# Altium schematic sheet Sheet2.SchDoc
size A; SheetNumber: 2; SheetTotal: 3
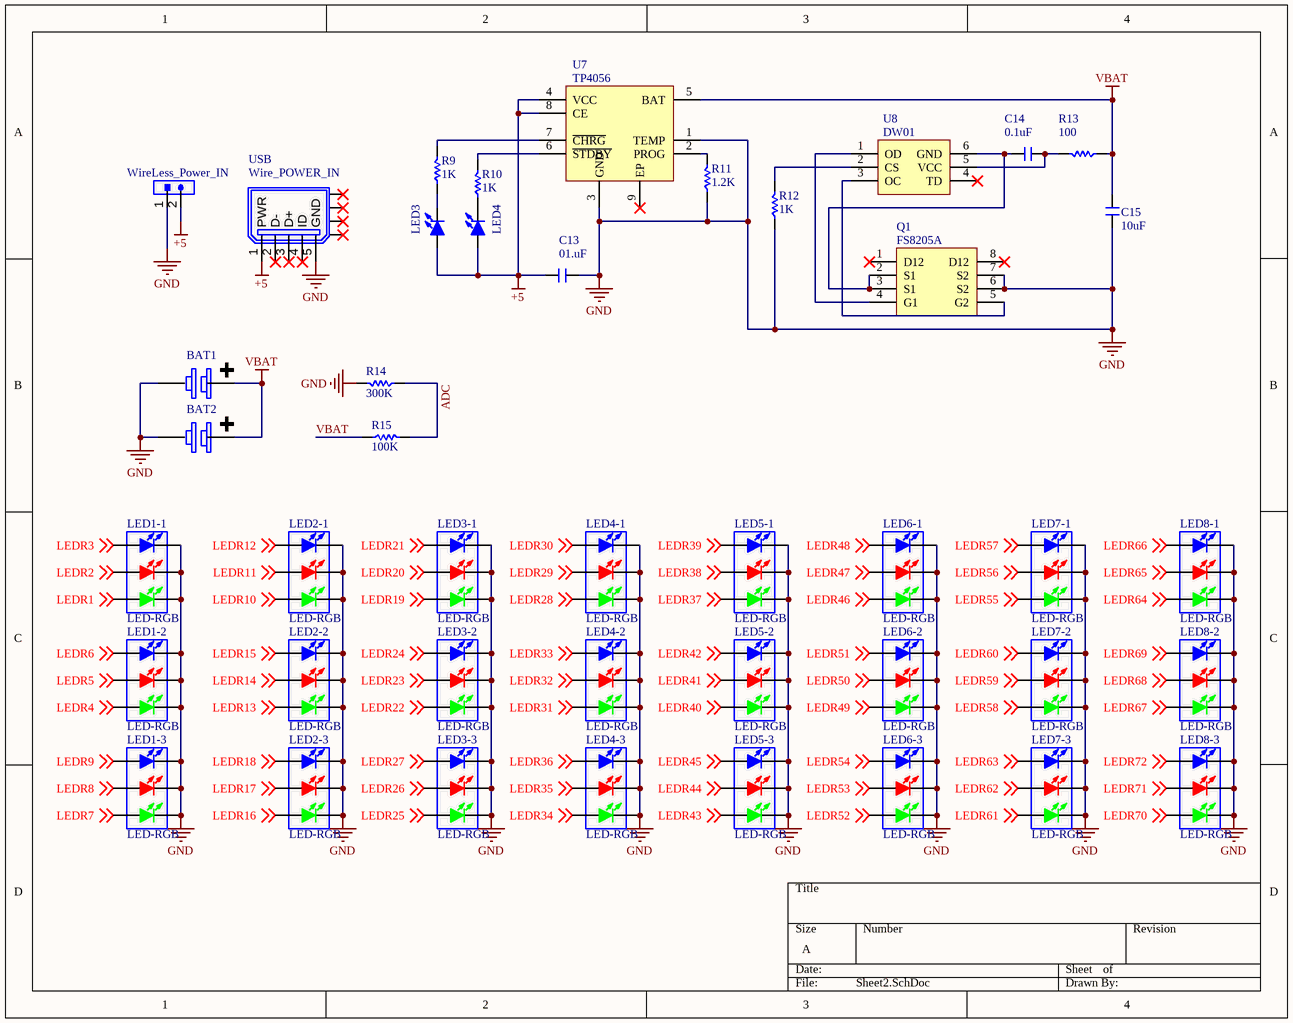
[diagram p0: Sheet2.SchDoc]

## Parts
BAT1  Battery 1850  [18650 Single]  (value not drawn)
BAT2  Battery 1850  [18650 Single]  (value not drawn)
C13  01.uF  [C 0402]
C14  0.1uF  [C 0402]
C15  10uF  [C 0603]
LED1-1  LED-RGB  [LED 5050]
LED1-2  LED-RGB  [LED 5050]
LED1-3  LED-RGB  [LED 5050]
LED2-1  LED-RGB  [LED 5050]
LED2-2  LED-RGB  [LED 5050]
LED2-3  LED-RGB  [LED 5050]
LED3  LED-SMD  [LED 0805R]  (value not drawn)
LED3-1  LED-RGB  [LED 5050]
LED3-2  LED-RGB  [LED 5050]
LED3-3  LED-RGB  [LED 5050]
LED4  LED-SMD  [LED 0805G]  (value not drawn)
LED4-1  LED-RGB  [LED 5050]
LED4-2  LED-RGB  [LED 5050]
LED4-3  LED-RGB  [LED 5050]
LED5-1  LED-RGB  [LED 5050]
LED5-2  LED-RGB  [LED 5050]
LED5-3  LED-RGB  [LED 5050]
LED6-1  LED-RGB  [LED 5050]
LED6-2  LED-RGB  [LED 5050]
LED6-3  LED-RGB  [LED 5050]
LED7-1  LED-RGB  [LED 5050]
LED7-2  LED-RGB  [LED 5050]
LED7-3  LED-RGB  [LED 5050]
LED8-1  LED-RGB  [LED 5050]
LED8-2  LED-RGB  [LED 5050]
LED8-3  LED-RGB  [LED 5050]
Q1  FS8205A  [SSOP8_L]
R9  1K  [R 0402]
R10  1K  [R 0402]
R11  1.2K  [R 0402]
R12  1K  [R 0402]
R13  100  [R 0402]
R14  300K  [R 0805]
R15  100K  [R 0805]
U7  TP4056  [SOP8_M-EP]
U8  DW01  [SOT23-6M]
USB  Wire_POWER_IN  [USB-micro_B]
WireLess_Power_IN  HDR-1X2  [XH2.54-2P]  (value not drawn)

## Nets
+5: C13.2 LED3.1(A) LED4.1(A) U7.4(VCC) U7.8(CE) USB.1(PWR) WireLess_Power_IN.2
GND: BAT1.2(-) BAT2.2(-) C13.1 C15.1 LED1-1.2(BULE_K) LED1-1.4(RED_K) LED1-1.6(GREEN_K) LED1-2.2(BULE_K) LED1-2.4(RED_K) LED1-2.6(GREEN_K) LED1-3.2(BULE_K) LED1-3.4(RED_K) LED1-3.6(GREEN_K) LED2-1.2(BULE_K) LED2-1.4(RED_K) LED2-1.6(GREEN_K) LED2-2.2(BULE_K) LED2-2.4(RED_K) LED2-2.6(GREEN_K) LED2-3.2(BULE_K) LED2-3.4(RED_K) LED2-3.6(GREEN_K) LED3-1.2(BULE_K) LED3-1.4(RED_K) LED3-1.6(GREEN_K) LED3-2.2(BULE_K) LED3-2.4(RED_K) LED3-2.6(GREEN_K) LED3-3.2(BULE_K) LED3-3.4(RED_K) LED3-3.6(GREEN_K) LED4-1.2(BULE_K) LED4-1.4(RED_K) LED4-1.6(GREEN_K) LED4-2.2(BULE_K) LED4-2.4(RED_K) LED4-2.6(GREEN_K) LED4-3.2(BULE_K) LED4-3.4(RED_K) LED4-3.6(GREEN_K) LED5-1.2(BULE_K) LED5-1.4(RED_K) LED5-1.6(GREEN_K) LED5-2.2(BULE_K) LED5-2.4(RED_K) LED5-2.6(GREEN_K) LED5-3.2(BULE_K) LED5-3.4(RED_K) LED5-3.6(GREEN_K) LED6-1.2(BULE_K) LED6-1.4(RED_K) LED6-1.6(GREEN_K) LED6-2.2(BULE_K) LED6-2.4(RED_K) LED6-2.6(GREEN_K) LED6-3.2(BULE_K) LED6-3.4(RED_K) LED6-3.6(GREEN_K) LED7-1.2(BULE_K) LED7-1.4(RED_K) LED7-1.6(GREEN_K) LED7-2.2(BULE_K) LED7-2.4(RED_K) LED7-2.6(GREEN_K) LED7-3.2(BULE_K) LED7-3.4(RED_K) LED7-3.6(GREEN_K) LED8-1.2(BULE_K) LED8-1.4(RED_K) LED8-1.6(GREEN_K) LED8-2.2(BULE_K) LED8-2.4(RED_K) LED8-2.6(GREEN_K) LED8-3.2(BULE_K) LED8-3.4(RED_K) LED8-3.6(GREEN_K) Q1.6(S2) Q1.7(S2) R11.1 R12.1 R14.2 U7.1(TEMP) U7.3(GND) USB.5(SHIELD) WireLess_Power_IN.1
VBAT: BAT1.1(+) BAT2.1(+) C15.2 R13.1 R15.1 U7.5(BAT)
ADC: R14.1 R15.2
LEDR1: LED1-1.5(GREEN_A) ; off-sheet LEDR1
LEDR2: LED1-1.3(RED_A) ; off-sheet LEDR2
LEDR3: LED1-1.1(BULE_A) ; off-sheet LEDR3
LEDR4: LED1-2.5(GREEN_A) ; off-sheet LEDR4
LEDR5: LED1-2.3(RED_A) ; off-sheet LEDR5
LEDR6: LED1-2.1(BULE_A) ; off-sheet LEDR6
LEDR7: LED1-3.5(GREEN_A) ; off-sheet LEDR7
LEDR8: LED1-3.3(RED_A) ; off-sheet LEDR8
LEDR9: LED1-3.1(BULE_A) ; off-sheet LEDR9
LEDR10: LED2-1.5(GREEN_A) ; off-sheet LEDR10
LEDR11: LED2-1.3(RED_A) ; off-sheet LEDR11
LEDR12: LED2-1.1(BULE_A) ; off-sheet LEDR12
LEDR13: LED2-2.5(GREEN_A) ; off-sheet LEDR13
LEDR14: LED2-2.3(RED_A) ; off-sheet LEDR14
LEDR15: LED2-2.1(BULE_A) ; off-sheet LEDR15
LEDR16: LED2-3.5(GREEN_A) ; off-sheet LEDR16
LEDR17: LED2-3.3(RED_A) ; off-sheet LEDR17
LEDR18: LED2-3.1(BULE_A) ; off-sheet LEDR18
LEDR19: LED3-1.5(GREEN_A) ; off-sheet LEDR19
LEDR20: LED3-1.3(RED_A) ; off-sheet LEDR20
LEDR21: LED3-1.1(BULE_A) ; off-sheet LEDR21
LEDR22: LED3-2.5(GREEN_A) ; off-sheet LEDR22
LEDR23: LED3-2.3(RED_A) ; off-sheet LEDR23
LEDR24: LED3-2.1(BULE_A) ; off-sheet LEDR24
LEDR25: LED3-3.5(GREEN_A) ; off-sheet LEDR25
LEDR26: LED3-3.3(RED_A) ; off-sheet LEDR26
LEDR27: LED3-3.1(BULE_A) ; off-sheet LEDR27
LEDR28: LED4-1.5(GREEN_A) ; off-sheet LEDR28
LEDR29: LED4-1.3(RED_A) ; off-sheet LEDR29
LEDR30: LED4-1.1(BULE_A) ; off-sheet LEDR30
LEDR31: LED4-2.5(GREEN_A) ; off-sheet LEDR31
LEDR32: LED4-2.3(RED_A) ; off-sheet LEDR32
LEDR33: LED4-2.1(BULE_A) ; off-sheet LEDR33
LEDR34: LED4-3.5(GREEN_A) ; off-sheet LEDR34
LEDR35: LED4-3.3(RED_A) ; off-sheet LEDR35
LEDR36: LED4-3.1(BULE_A) ; off-sheet LEDR36
LEDR37: LED5-1.5(GREEN_A) ; off-sheet LEDR37
LEDR38: LED5-1.3(RED_A) ; off-sheet LEDR38
LEDR39: LED5-1.1(BULE_A) ; off-sheet LEDR39
LEDR40: LED5-2.5(GREEN_A) ; off-sheet LEDR40
LEDR41: LED5-2.3(RED_A) ; off-sheet LEDR41
LEDR42: LED5-2.1(BULE_A) ; off-sheet LEDR42
LEDR43: LED5-3.5(GREEN_A) ; off-sheet LEDR43
LEDR44: LED5-3.3(RED_A) ; off-sheet LEDR44
LEDR45: LED5-3.1(BULE_A) ; off-sheet LEDR45
LEDR46: LED6-1.5(GREEN_A) ; off-sheet LEDR46
LEDR47: LED6-1.3(RED_A) ; off-sheet LEDR47
LEDR48: LED6-1.1(BULE_A) ; off-sheet LEDR48
LEDR49: LED6-2.5(GREEN_A) ; off-sheet LEDR49
LEDR50: LED6-2.3(RED_A) ; off-sheet LEDR50
LEDR51: LED6-2.1(BULE_A) ; off-sheet LEDR51
LEDR52: LED6-3.5(GREEN_A) ; off-sheet LEDR52
LEDR53: LED6-3.3(RED_A) ; off-sheet LEDR53
LEDR54: LED6-3.1(BULE_A) ; off-sheet LEDR54
LEDR55: LED7-1.5(GREEN_A) ; off-sheet LEDR55
LEDR56: LED7-1.3(RED_A) ; off-sheet LEDR56
LEDR57: LED7-1.1(BULE_A) ; off-sheet LEDR57
LEDR58: LED7-2.5(GREEN_A) ; off-sheet LEDR58
LEDR59: LED7-2.3(RED_A) ; off-sheet LEDR59
LEDR60: LED7-2.1(BULE_A) ; off-sheet LEDR60
LEDR61: LED7-3.5(GREEN_A) ; off-sheet LEDR61
LEDR62: LED7-3.3(RED_A) ; off-sheet LEDR62
LEDR63: LED7-3.1(BULE_A) ; off-sheet LEDR63
LEDR64: LED8-1.5(GREEN_A) ; off-sheet LEDR64
LEDR65: LED8-1.3(RED_A) ; off-sheet LEDR65
LEDR66: LED8-1.1(BULE_A) ; off-sheet LEDR66
LEDR67: LED8-2.5(GREEN_A) ; off-sheet LEDR67
LEDR68: LED8-2.3(RED_A) ; off-sheet LEDR68
LEDR69: LED8-2.1(BULE_A) ; off-sheet LEDR69
LEDR70: LED8-3.5(GREEN_A) ; off-sheet LEDR70
LEDR71: LED8-3.3(RED_A) ; off-sheet LEDR71
LEDR72: LED8-3.1(BULE_A) ; off-sheet LEDR72
NetC14_1: C14.1 Q1.2(S1) Q1.3(S1) U8.6(GND)
NetC14_2: C14.2 R13.2 U8.5(VCC)
NetLED3_2: LED3.2(K) R9.1
NetLED4_2: LED4.2(K) R10.1
NetQ1_4: Q1.4(G1) U8.1(OD)
NetQ1_5: Q1.5(G2) U8.3(OC)
NetR9_2: R9.2 U7.7(~{CHRG})
NetR10_2: R10.2 U7.6(~{STDBY})
NetR11_2: R11.2 U7.2(PROG)
NetR12_2: R12.2 U8.2(CS)

Not connected (* = marked no-connect by the designer): Q1 1(D12)* 8(D12)*; U7 9(EP)*; U8 4(TD)*; USB 2(D-)* 3(D+)* 4(ID)*

## Library data of the parts
C13-C15 = C: Non-polar patch capacitor; BOM名称: 无极性贴片电容; 版权归属: 源创客; 学习资源: www.ooocke.com
LED1-1-LED1-3 LED2-1-LED2-3 LED3-1-LED3-3 LED4-1-LED4-3 LED5-1-LED5-3 LED6-1-LED6-3 LED7-1-LED7-3 LED8-1-LED8-3 = LED-RGB: Three primary color LED; BOM名称: 三基色LED; 版权归属: 源创客; 学习资源: www.ooocke.com
LED3 LED4 = LED-SMD: Patch LED; BOM名称: 贴片LED; 版权归属: 源创客; 学习资源: www.ooocke.com
Q1 = FS8205A: Dual N-Channel Enhancement Mode Power MOSFET
R9-R15 = R: Chip resistor; 版权归属: 源创客; BOM名称: Chip resistor; 学习资源: www.ooocke.com
U7 = TP4056: Lithium battery charge management; BOM名称: 锂电池充电管理; 版权归属: 源创客; 学习资源: www.ooocke.com
U8 = DW01: Lithium battery overcurrent protection IC; BOM名称: 过流保护IC; 版权归属: 源创客; 学习资源: www.ooocke.com
USB = USB-5P: Micro & Mini USB female; BOM名称: 微型USB母座; 版权归属: 源创客; 学习资源: www.ooocke.com
WireLess_Power_IN = Header 2: 2P Connector; BOM名称: 2P接插件; 版权归属: 源创客; 学习资源: www.ooocke.com